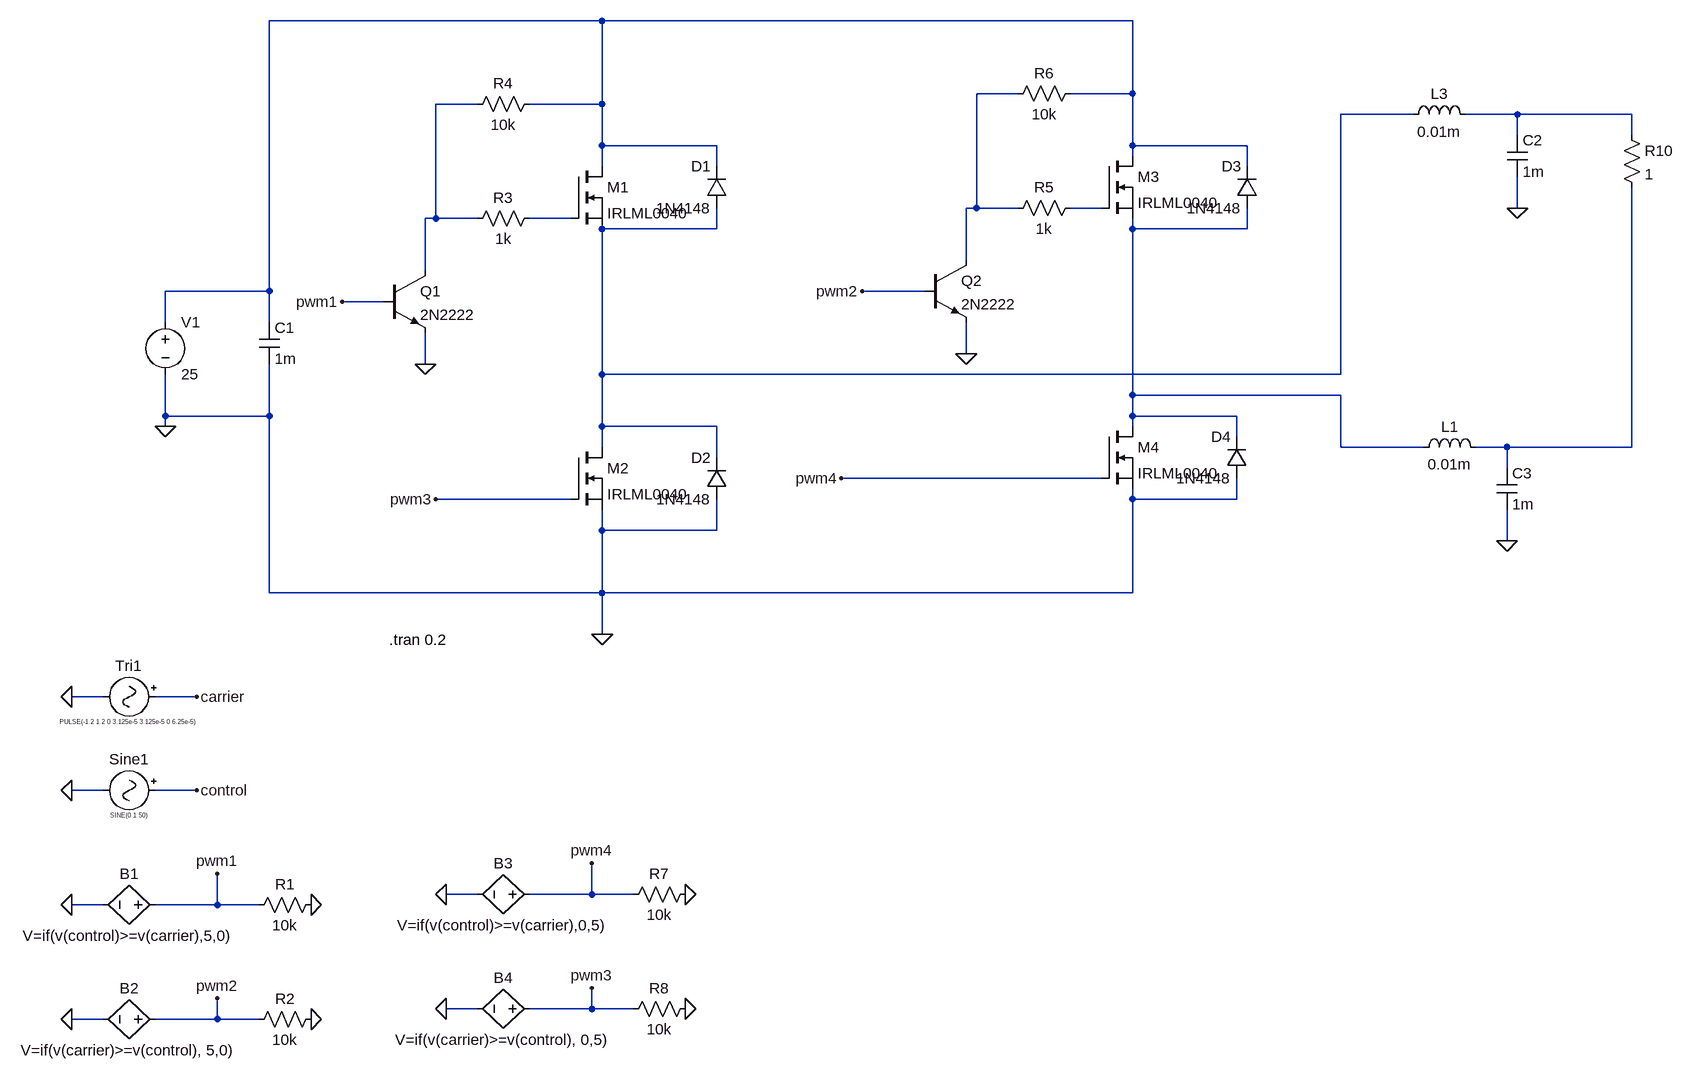
[diagram p0: schematic Draft2.asc]
Draft2.asc, the LTspice schematic file:
Version 4
SHEET 1 1780 1000
WIRE 128 -592 -384 -592
WIRE 944 -592 128 -592
WIRE 768 -480 704 -480
WIRE 944 -480 944 -592
WIRE 944 -480 848 -480
WIRE -64 -464 -128 -464
WIRE 128 -464 128 -592
WIRE 128 -464 16 -464
WIRE 1376 -448 1264 -448
WIRE 1536 -448 1456 -448
WIRE 1712 -448 1536 -448
WIRE 1536 -416 1536 -448
WIRE 1712 -416 1712 -448
WIRE 128 -400 128 -464
WIRE 304 -400 128 -400
WIRE 944 -400 944 -480
WIRE 1120 -400 944 -400
WIRE 944 -384 944 -400
WIRE 128 -368 128 -400
WIRE 304 -368 304 -400
WIRE 1120 -368 1120 -400
WIRE 704 -304 704 -480
WIRE 704 -304 688 -304
WIRE 768 -304 704 -304
WIRE 896 -304 848 -304
WIRE 1536 -304 1536 -352
WIRE -128 -288 -128 -464
WIRE -128 -288 -144 -288
WIRE -64 -288 -128 -288
WIRE 80 -288 16 -288
WIRE 304 -272 304 -304
WIRE 304 -272 128 -272
WIRE 944 -272 944 -288
WIRE 1120 -272 1120 -304
WIRE 1120 -272 944 -272
WIRE 688 -224 688 -304
WIRE -144 -208 -144 -288
WIRE -384 -176 -384 -592
WIRE -384 -176 -544 -176
WIRE 624 -176 528 -176
WIRE -208 -160 -272 -160
WIRE -544 -128 -544 -176
WIRE -384 -128 -384 -176
WIRE 688 -80 688 -128
WIRE -144 -64 -144 -112
WIRE 128 -48 128 -272
WIRE 1264 -48 1264 -448
WIRE 1264 -48 128 -48
WIRE 944 -16 944 -272
WIRE 1264 -16 944 -16
WIRE -544 16 -544 -48
WIRE -384 16 -384 -64
WIRE -384 16 -544 16
WIRE 944 16 944 -16
WIRE 1104 16 944 16
WIRE -544 32 -544 16
WIRE 128 32 128 -48
WIRE 304 32 128 32
WIRE 944 32 944 16
WIRE 1104 48 1104 16
WIRE 128 64 128 32
WIRE 1264 64 1264 -16
WIRE 1392 64 1264 64
WIRE 1520 64 1472 64
WIRE 1712 64 1712 -336
WIRE 1712 64 1520 64
WIRE 304 80 304 32
WIRE 1520 96 1520 64
WIRE 896 112 496 112
WIRE 80 144 -128 144
WIRE 944 144 944 128
WIRE 1104 144 1104 112
WIRE 1104 144 944 144
WIRE 128 192 128 160
WIRE 304 192 304 144
WIRE 304 192 128 192
WIRE 1520 208 1520 160
WIRE -384 288 -384 16
WIRE 128 288 128 192
WIRE 128 288 -384 288
WIRE 944 288 944 144
WIRE 944 288 128 288
WIRE 128 352 128 288
WIRE -640 448 -688 448
WIRE -496 448 -560 448
WIRE -640 592 -688 592
WIRE -496 592 -560 592
WIRE -64 752 -112 752
WIRE 112 752 112 704
WIRE 112 752 16 752
WIRE 176 752 112 752
WIRE -640 768 -688 768
WIRE -464 768 -464 720
WIRE -464 768 -560 768
WIRE -400 768 -464 768
WIRE -64 928 -112 928
WIRE 112 928 112 896
WIRE 112 928 16 928
WIRE 176 928 112 928
WIRE -640 944 -688 944
WIRE -464 944 -464 912
WIRE -464 944 -560 944
WIRE -400 944 -464 944
FLAG -544 32 0
FLAG -688 448 0
FLAG -688 592 0
FLAG -496 448 carrier
FLAG -496 592 control
FLAG -272 -160 pwm1
FLAG 496 112 pwm4
FLAG 528 -176 pwm2
FLAG -128 144 pwm3
FLAG -688 768 0
FLAG -688 944 0
FLAG -320 768 0
FLAG -320 944 0
FLAG -464 720 pwm1
FLAG -464 912 pwm2
FLAG -144 -64 0
FLAG 688 -80 0
FLAG 128 352 0
FLAG -112 752 0
FLAG 256 752 0
FLAG 112 704 pwm4
FLAG -112 928 0
FLAG 256 928 0
FLAG 112 896 pwm3
FLAG 1536 -304 0
FLAG 1520 208 0
SYMBOL voltage -544 -144 R0
SYMATTR InstName V1
SYMATTR Value 25
SYMATTR SpiceLine Rser=0.
SYMBOL cap -400 -128 R0
SYMATTR InstName C1
SYMATTR Value 1m
SYMATTR SpiceLine Rser=34m Lser=0 mfg="Chemi-Con" pn="LXF25VB102M12X25LL" type="Al electrolytic"
SYMBOL signal -544 448 R90
WINDOW 0 -32 56 VBottom 2
WINDOW 3 32 56 VTop 0
SYMATTR InstName Tri1
SYMATTR Value PULSE(-1.2 1.2 0 3.125e-5 3.125e-5 0 6.25e-5)
SYMBOL signal -544 592 R90
WINDOW 0 -32 56 VBottom 2
WINDOW 3 32 56 VTop 0
SYMATTR InstName Sine1
SYMATTR Value SINE(0 1 50)
SYMBOL bv -544 768 R90
WINDOW 0 -32 56 VBottom 2
WINDOW 3 32 56 VTop 2
SYMATTR InstName B1
SYMATTR Value V=if(v(control)>=v(carrier),5,0)
SYMBOL bv -544 944 R90
WINDOW 0 -32 56 VBottom 2
WINDOW 3 32 56 VTop 2
SYMATTR InstName B2
SYMATTR Value V=if(v(carrier)>=v(control), 5,0)
SYMBOL Res -304 752 R90
WINDOW 0 0 56 VBottom 2
WINDOW 3 32 56 VTop 2
SYMATTR InstName R1
SYMATTR Value 10k
SYMBOL Res -304 928 R90
WINDOW 0 0 56 VBottom 2
WINDOW 3 32 56 VTop 2
SYMATTR InstName R2
SYMATTR Value 10k
SYMBOL nmos 80 -368 R0
SYMATTR InstName M1
SYMATTR Value IRLML0040
SYMBOL nmos 80 64 R0
SYMATTR InstName M2
SYMATTR Value IRLML0040
SYMBOL nmos 896 -384 R0
SYMATTR InstName M3
SYMATTR Value IRLML0040
SYMBOL nmos 896 32 R0
SYMATTR InstName M4
SYMATTR Value IRLML0040
SYMBOL diode 320 -304 R180
WINDOW 0 24 64 Left 2
WINDOW 3 24 0 Left 2
SYMATTR InstName D1
SYMATTR Value 1N4148
SYMBOL diode 320 144 R180
WINDOW 0 24 64 Left 2
WINDOW 3 24 0 Left 2
SYMATTR InstName D2
SYMATTR Value 1N4148
SYMBOL diode 1136 -304 R180
WINDOW 0 24 64 Left 2
WINDOW 3 24 0 Left 2
SYMATTR InstName D3
SYMATTR Value 1N4148
SYMBOL diode 1120 112 R180
WINDOW 0 24 64 Left 2
WINDOW 3 24 0 Left 2
SYMATTR InstName D4
SYMATTR Value 1N4148
SYMBOL npn -208 -208 R0
SYMATTR InstName Q1
SYMATTR Value 2N2222
SYMBOL Res 32 -304 R90
WINDOW 0 0 56 VBottom 2
WINDOW 3 32 56 VTop 2
SYMATTR InstName R3
SYMATTR Value 1k
SYMBOL Res 32 -480 R90
WINDOW 0 0 56 VBottom 2
WINDOW 3 32 56 VTop 2
SYMATTR InstName R4
SYMATTR Value 10k
SYMBOL npn 624 -224 R0
SYMATTR InstName Q2
SYMATTR Value 2N2222
SYMBOL Res 864 -320 R90
WINDOW 0 0 56 VBottom 2
WINDOW 3 32 56 VTop 2
SYMATTR InstName R5
SYMATTR Value 1k
SYMBOL Res 864 -496 R90
WINDOW 0 0 56 VBottom 2
WINDOW 3 32 56 VTop 2
SYMATTR InstName R6
SYMATTR Value 10k
SYMBOL bv 32 752 R90
WINDOW 0 -32 56 VBottom 2
WINDOW 3 32 56 VTop 2
SYMATTR InstName B3
SYMATTR Value V=if(v(control)>=v(carrier),0,5)
SYMBOL Res 272 736 R90
WINDOW 0 0 56 VBottom 2
WINDOW 3 32 56 VTop 2
SYMATTR InstName R7
SYMATTR Value 10k
SYMBOL bv 32 928 R90
WINDOW 0 -32 56 VBottom 2
WINDOW 3 32 56 VTop 2
SYMATTR InstName B4
SYMATTR Value V=if(v(carrier)>=v(control), 0,5)
SYMBOL Res 272 912 R90
WINDOW 0 0 56 VBottom 2
WINDOW 3 32 56 VTop 2
SYMATTR InstName R8
SYMATTR Value 10k
SYMBOL Cap 1520 -416 R0
SYMATTR InstName C2
SYMATTR Value 1m
SYMBOL ind 1376 80 R270
WINDOW 0 32 56 VTop 2
WINDOW 3 5 56 VBottom 2
SYMATTR InstName L1
SYMATTR Value 0.01m
SYMBOL Cap 1504 96 R0
SYMATTR InstName C3
SYMATTR Value 1m
SYMBOL ind 1360 -432 R270
WINDOW 0 32 56 VTop 2
WINDOW 3 5 56 VBottom 2
SYMATTR InstName L3
SYMATTR Value 0.01m
SYMBOL Res 1696 -432 R0
SYMATTR InstName R10
SYMATTR Value 1
TEXT -200 360 Left 2 !.tran 0.2

The netlist it stands for:
* Draft2.asc
V1 N001 0 25 Rser=0.
C1 N001 0 1m Rser=34m Lser=0 mfg="Chemi-Con" pn="LXF25VB102M12X25LL" type="Al electrolytic"
V§Tri1 carrier 0 PULSE(-1.2 1.2 0 3.125e-5 3.125e-5 0 6.25e-5)
V§Sine1 control 0 SINE(0 1 50)
B1 pwm1 0 V=if(v(control)>=v(carrier),5,0)
B2 pwm2 0 V=if(v(carrier)>=v(control), 5,0)
R1 0 pwm1 10k
R2 0 pwm2 10k
M1 N001 N007 N004 N004 IRLML0040
M2 N004 pwm3 0 0 IRLML0040
M3 N001 N006 N008 N008 IRLML0040
M4 N008 pwm4 0 0 IRLML0040
D1 N004 N001 1N4148
D2 0 N004 1N4148
D3 N008 N001 1N4148
D4 0 N008 1N4148
Q1 N003 pwm1 0 0 2N2222
R3 N007 N003 1k
R4 N001 N003 10k
Q2 N002 pwm2 0 0 2N2222
R5 N006 N002 1k
R6 N001 N002 10k
B3 pwm4 0 V=if(v(control)>=v(carrier),0,5)
R7 0 pwm4 10k
B4 pwm3 0 V=if(v(carrier)>=v(control), 0,5)
R8 0 pwm3 10k
C2 N005 0 1m
L1 N008 N009 0.01m
C3 N009 0 1m
L3 N004 N005 0.01m
R10 N005 N009 1
.model D D
.lib standard.dio
.model NPN NPN
.model PNP PNP
.lib standard.bjt
.model NMOS NMOS
.model PMOS PMOS
.lib standard.mos
.tran 0.2
.backanno
.end